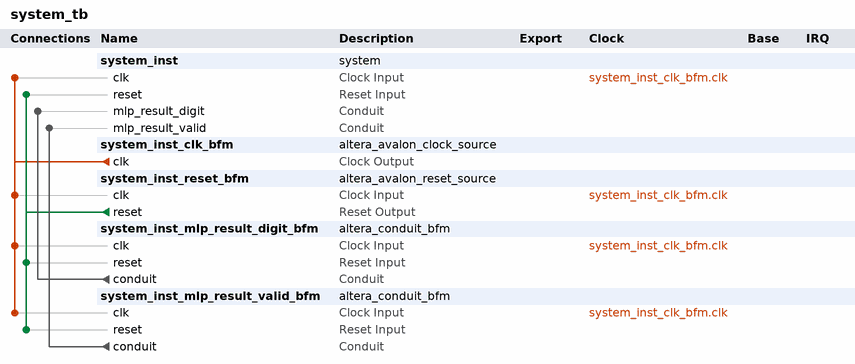
[diagram p0: system contents]
# Platform Designer (Qsys) system system_tb, Cyclone V 5CSXFC6D6F31C6
# Parameters at their usual value, and those the tool derives, are not listed.
package require -exact qsys 18.1
create_system system_tb
set_project_property DEVICE_FAMILY {Cyclone V}
set_project_property DEVICE 5CSXFC6D6F31C6

add_instance system_inst system 1.0

add_instance system_inst_clk_bfm altera_avalon_clock_source 18.1

add_instance system_inst_reset_bfm altera_avalon_reset_source 18.1
set_instance_parameter_value system_inst_reset_bfm ASSERT_HIGH_RESET 0
set_instance_parameter_value system_inst_reset_bfm INITIAL_RESET_CYCLES 50

add_instance system_inst_mlp_result_digit_bfm altera_conduit_bfm 18.1
set_instance_parameter_value system_inst_mlp_result_digit_bfm CLOCKED_SIGNAL true
set_instance_parameter_value system_inst_mlp_result_digit_bfm ENABLE_RESET true
set_instance_parameter_value system_inst_mlp_result_digit_bfm SIGNAL_DIRECTIONS input
set_instance_parameter_value system_inst_mlp_result_digit_bfm SIGNAL_ROLES result_digit
set_instance_parameter_value system_inst_mlp_result_digit_bfm SIGNAL_WIDTHS 4

add_instance system_inst_mlp_result_valid_bfm altera_conduit_bfm 18.1
set_instance_parameter_value system_inst_mlp_result_valid_bfm CLOCKED_SIGNAL true
set_instance_parameter_value system_inst_mlp_result_valid_bfm ENABLE_RESET true
set_instance_parameter_value system_inst_mlp_result_valid_bfm SIGNAL_DIRECTIONS input
set_instance_parameter_value system_inst_mlp_result_valid_bfm SIGNAL_ROLES result_valid
set_instance_parameter_value system_inst_mlp_result_valid_bfm SIGNAL_WIDTHS 1

# connections
add_connection system_inst_clk_bfm.clk system_inst.clk clock
add_connection system_inst_clk_bfm.clk system_inst_mlp_result_digit_bfm.clk clock
add_connection system_inst_clk_bfm.clk system_inst_mlp_result_valid_bfm.clk clock
add_connection system_inst_clk_bfm.clk system_inst_reset_bfm.clk clock
add_connection system_inst_reset_bfm.reset system_inst.reset reset
add_connection system_inst_reset_bfm.reset system_inst_mlp_result_digit_bfm.reset reset
add_connection system_inst_reset_bfm.reset system_inst_mlp_result_valid_bfm.reset reset
add_connection system_inst_mlp_result_digit_bfm.conduit system_inst.mlp_result_digit conduit
add_connection system_inst_mlp_result_valid_bfm.conduit system_inst.mlp_result_valid conduit

set_interconnect_requirement {$system} qsys_mm.clockCrossingAdapter HANDSHAKE
set_interconnect_requirement {$system} qsys_mm.enableEccProtection FALSE
set_interconnect_requirement {$system} qsys_mm.insertDefaultSlave FALSE
set_interconnect_requirement {$system} qsys_mm.maxAdditionalLatency 1

save_system system_tb.qsys
